# EasyEDA Pro project PCB-steeringWheel.epro

# Board PCB1
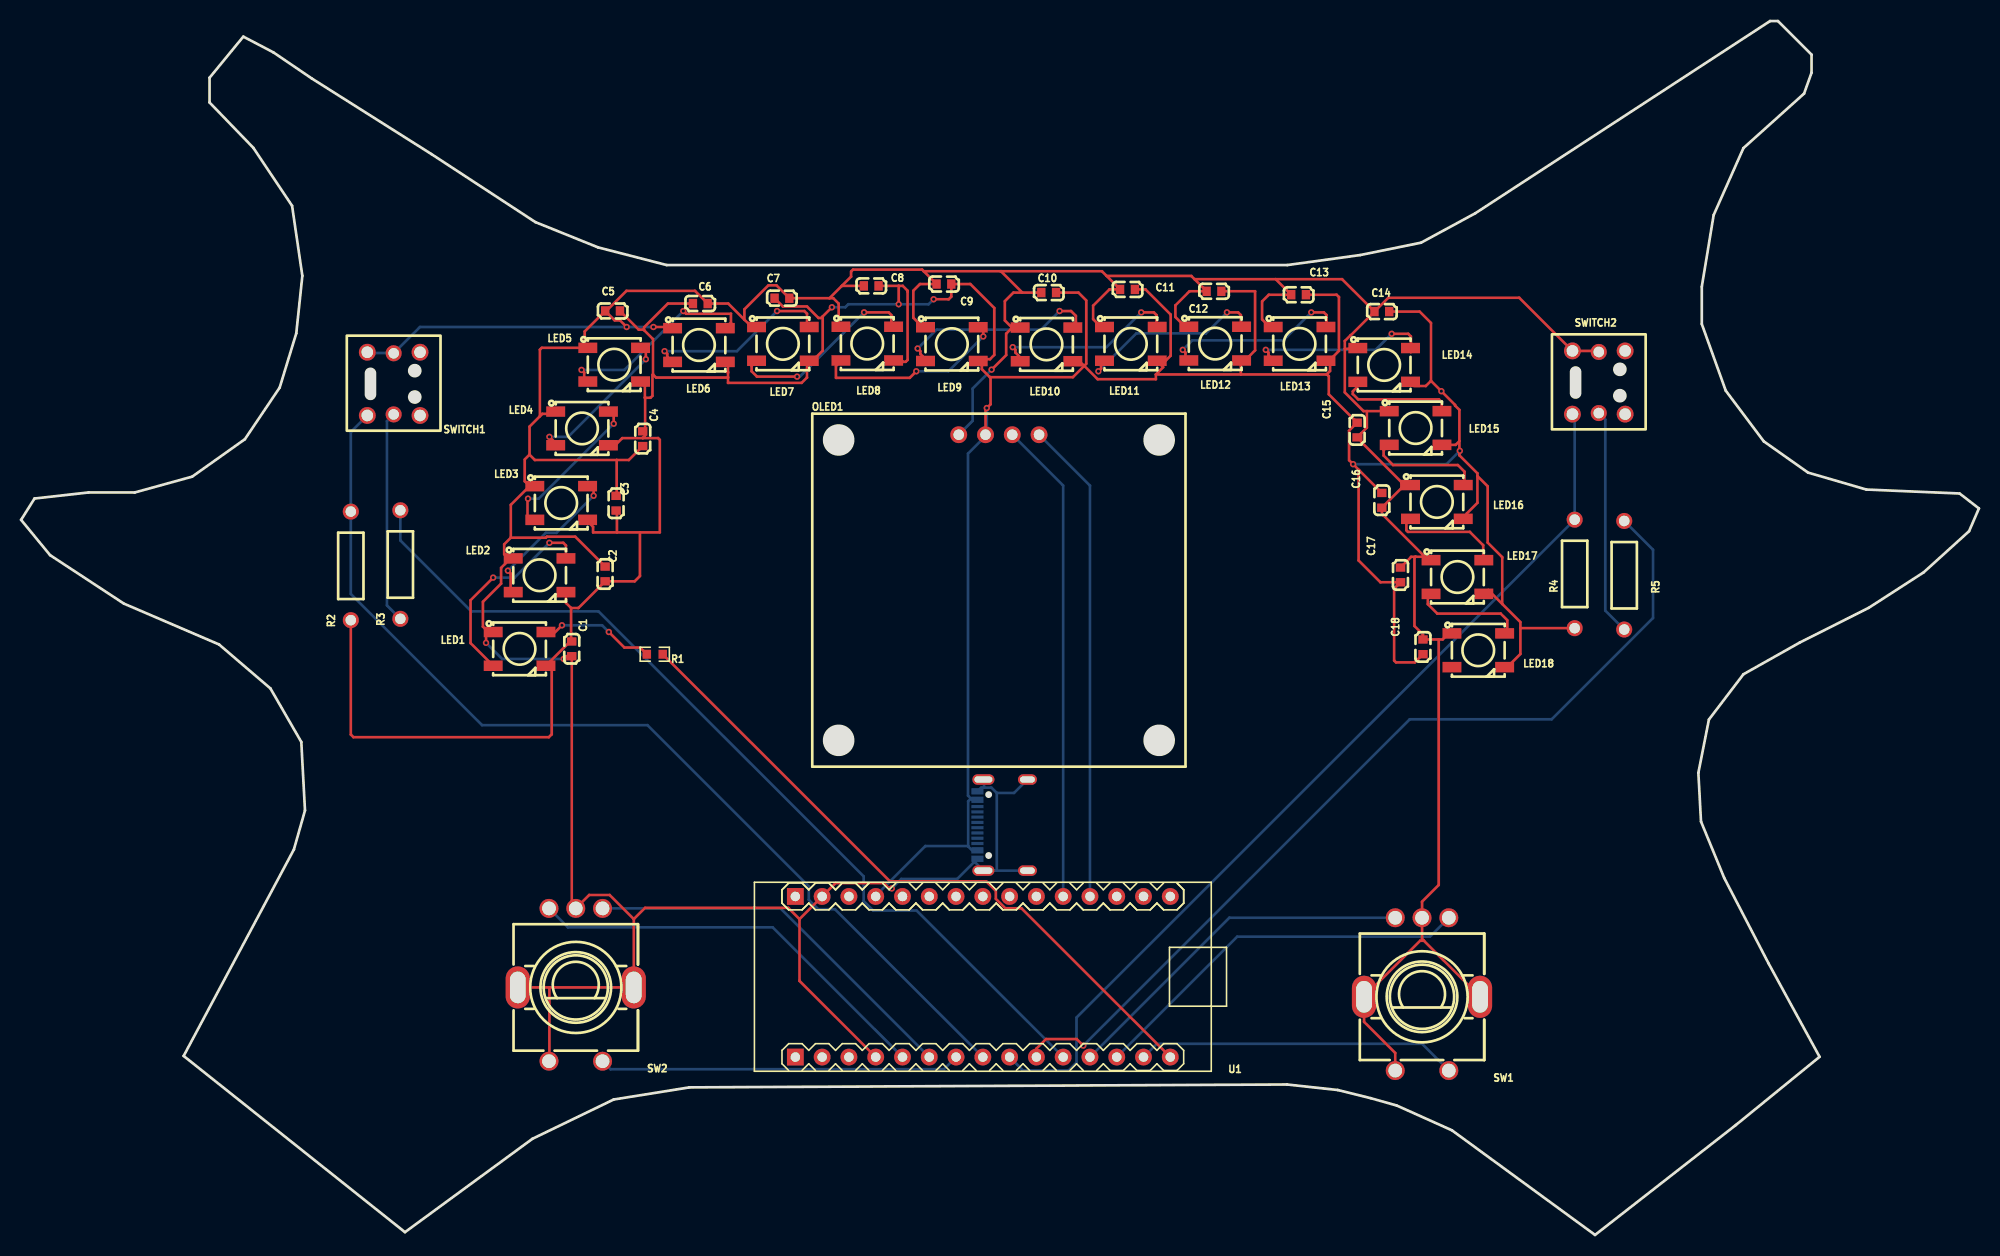
[diagram p0: board, top side]
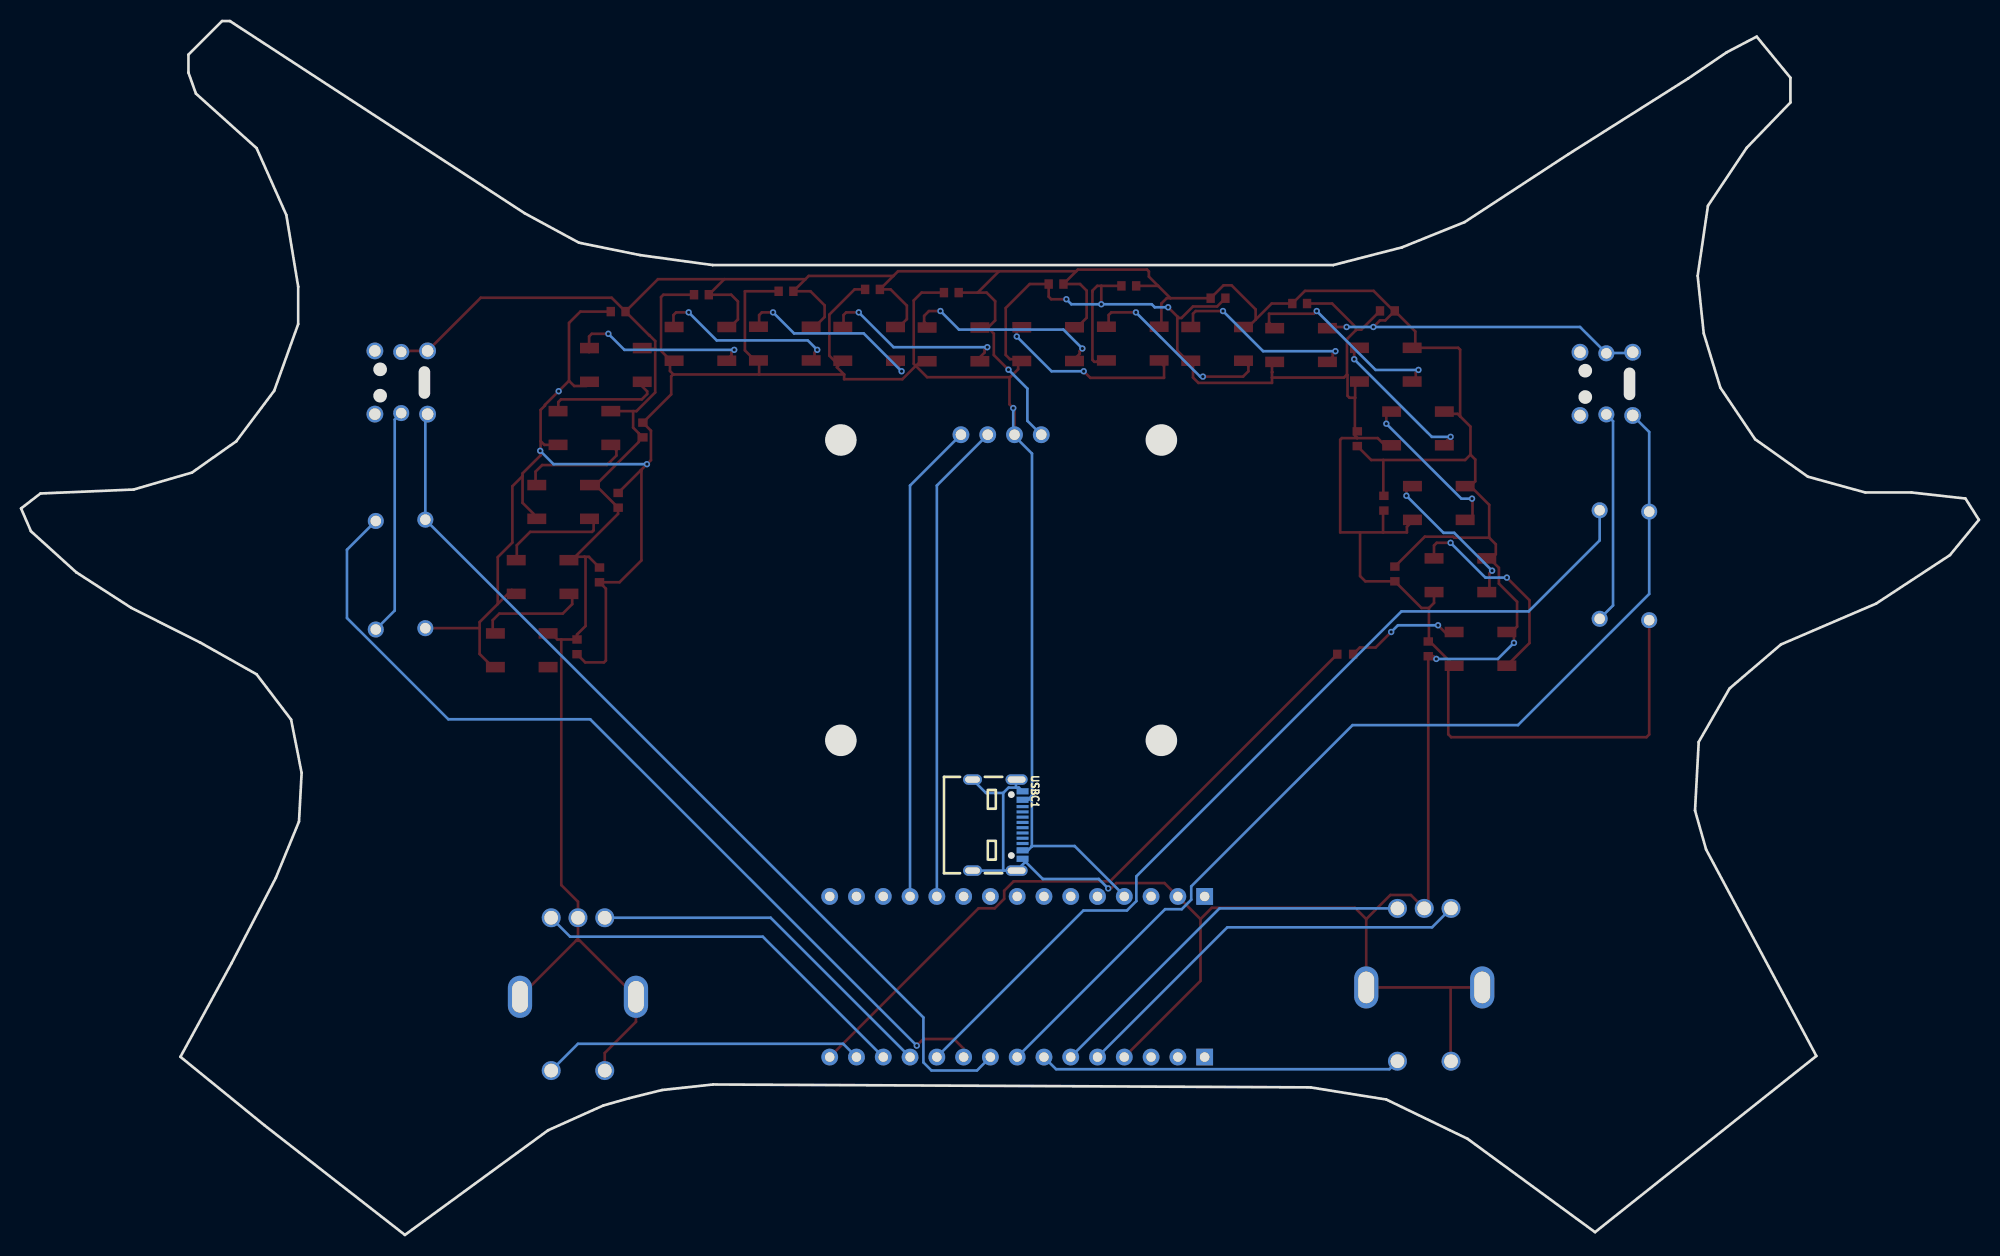
[diagram p1: board, bottom side, seen from below]

Outline 185.69 x 115.18 mm; copper layers: Top Layer, Bottom Layer. Coordinates in mm from the lower left corner of the outline.
Outline path: 0,67.85 2.75,64.5 9.75,59.9 18.78,56.03 23.65,51.85 26.58,46.78 26.93,40.28 25.88,36.58 15.42,16.98 36.41,0.26 48.5,9.13 56.2,12.85 63.38,14 120.06,14.28 124.88,13.75 128.01,12.98 130.48,12.28 135.71,9.93 149.28,0 162.63,10.43 170.58,16.9 165.73,25.78 161.53,33.88 159.33,39.23 159.08,43.85 160.08,48.9 163.36,53.2 168.68,56.2 175.23,59.5 180.46,62.88 184.76,66.78 185.69,68.93 183.86,70.35 175.01,70.73 169.48,72.34 165.28,75.3 161.68,80.1 159.41,86.43 159.41,89.98 160.53,96.78 163.36,103.13 169.11,108.3 169.82,110.28 169.82,112 166.63,115.18 165.88,115.18 137.92,96.94 132.78,94.15 127.01,92.98 120.09,92.03 61.23,92.03 54.73,93.7 48.78,96.1 38.92,102.56 27.58,109.73 23.94,112.21 21.08,113.71 17.88,109.8 17.88,107.45 22.03,103.15 25.7,97.65 26.68,91 26.1,85.55 24.53,80.4 21.23,75.5 16.23,71.95 10.78,70.45 6.4,70.45 1.27,69.88 0,67.85
Stack: Top Layer 0.035mm / Dielectric1 1.51mm FR4 er 4.5 / Bottom Layer 0.035mm

## Design rules (mm)
template: JLCPCB Capability(Two Layers Board)
spacing copperThickness1oz (default): track to track 0.102, other pairs 0.152 to 0.3
spacing copperThickness2oz: track to track 0.203, other pairs 0.152 to 0.3
track width copperThickness1oz (default): min 0.127, default 0.254, max 2.54
track width copperThickness2oz: min 0.203, default 0.254, max 2.54
differential pair differentialPair (default): width min 0.127, default 0.254, max 2.54; gap min 0.152, default 0.152
via viaSize (default): diameter min 0.5, default 0.61, max 10; hole min 0.3, default 0.305, max 6.3

## Placement (name value [footprint] x y rotation side)
C1  100nF  [C0603]  52.23 55.61 270 top
C2  100nF  [C0603]  55.39 62.72 90 top
C3  100nF  [C0603]  56.44 69.43 90 top
C4  100nF  [C0603]  58.96 75.55 270 top
C5  100nF  [C0603]  56.1 87.68 180 top
C6  100nF  [C0603]  64.42 88.38 0 top
C7  100nF  [C0603]  72.17 88.89 0 top
C8  100nF  [C0603]  80.63 90.05 180 top
C9  100nF  [C0603]  87.53 90.23 180 top
C10  100nF  [C0603]  97.47 89.42 180 top
C11  100nF  [C0603]  104.94 89.72 180 top
C12  100nF  [C0603]  113.14 89.54 180 top
C13  100nF  [C0603]  121.17 89.21 180 top
C14  100nF  [C0603]  129.06 87.62 180 top
C15  100nF  [C0603]  126.72 76.38 270 top
C16  100nF  [C0603]  129.06 69.71 270 top
C17  100nF  [C0603]  130.83 62.63 90 top
C18  100nF  [C0603]  132.96 55.8 90 top
LED1  WS2812B-V5/W  [LED-SMD_4P-L5.0-W5.0-TL-1]  47.27 55.61 0 top
LED2  WS2812B-V5/W  [LED-SMD_4P-L5.0-W5.0-TL-1]  49.18 62.6 0 top
LED3  WS2812B-V5/W  [LED-SMD_4P-L5.0-W5.0-TL-1]  51.23 69.45 0 top
LED4  WS2812B-V5/W  [LED-SMD_4P-L5.0-W5.0-TL-1]  53.2 76.53 0 top
LED5  WS2812B-V5/W  [LED-SMD_4P-L5.0-W5.0-TL-1]  56.25 82.58 0 top
LED6  WS2812B-V5/W  [LED-SMD_4P-L5.0-W5.0-TL-1]  64.29 84.44 0 top
LED7  WS2812B-V5/W  [LED-SMD_4P-L5.0-W5.0-TL-1]  72.25 84.55 0 top
LED8  WS2812B-V5/W  [LED-SMD_4P-L5.0-W5.0-TL-1]  80.25 84.58 0 top
LED9  WS2812B-V5/W  [LED-SMD_4P-L5.0-W5.0-TL-1]  88.28 84.53 0 top
LED10  WS2812B-V5/W  [LED-SMD_4P-L5.0-W5.0-TL-1]  97.25 84.5 0 top
LED11  WS2812B-V5/W  [LED-SMD_4P-L5.0-W5.0-TL-1]  105.25 84.55 0 top
LED12  WS2812B-V5/W  [LED-SMD_4P-L5.0-W5.0-TL-1]  113.26 84.58 0 top
LED13  WS2812B-V5/W  [LED-SMD_4P-L5.0-W5.0-TL-1]  121.26 84.55 0 top
LED14  WS2812B-V5/W  [LED-SMD_4P-L5.0-W5.0-TL-1]  129.28 82.55 0 top
LED15  WS2812B-V5/W  [LED-SMD_4P-L5.0-W5.0-TL-1]  132.26 76.57 0 top
LED16  WS2812B-V5/W  [LED-SMD_4P-L5.0-W5.0-TL-1]  134.28 69.55 0 top
LED17  WS2812B-V5/W  [LED-SMD_4P-L5.0-W5.0-TL-1]  136.23 62.43 0 top
LED18  WS2812B-V5/W  [LED-SMD_4P-L5.0-W5.0-TL-1]  138.21 55.48 0 top
OLED1  HS13L03W2C01  [OLED-TH_L35.4-W33.5_HS13L03W2C01]  92.74 75.93 0 top
R1  470Ω  [R0603]  60.1 55.1 180 top
R2  220Ω  [RES-TH_BD2.4-L6.3-P10.30-D0.6]  31.27 63.49 90 top
R3  220Ω  [RES-TH_BD2.4-L6.3-P10.30-D0.6]  35.97 63.61 90 top
R4  220Ω  [RES-TH_BD2.4-L6.3-P10.30-D0.6]  147.35 62.72 90 top
R5  220Ω  [RES-TH_BD2.4-L6.3-P10.30-D0.6]  152.05 62.6 90 top
SW1  EC11E09244BS  [SW-TH_EC11XXXXXXXX]  132.87 22.85 180 top
SW2  EC11E09244BS  [SW-TH_EC11XXXXXXXX]  52.61 23.73 180 top
SWITCH1  K6-6275D03  [SW-TH_K6-6275D03]  35.34 80.76 180 top
SWITCH2  K6-6275D03  [SW-TH_K6-6275D03]  149.64 80.88 180 top
U1  ARDUINO_NANO  [COMM-TH_ARDUINO_NANO]  91.22 24.5 180 top
USBC1  MC-311D  [USB-C-SMD_MC-311D]  93.08 38.89 270 bottom

## Footprints (pads in the part's own frame, mm; a bottom-side part is the same pattern mirrored in y, then rotated)
C0603
  rect 0.8x0.9 smd: 1(-0.7,0) 2(0.7,0)
COMM-TH_ARDUINO_NANO
  rect 1.6x1.6 hole 0.9: 1(17.78,7.62) 30(17.78,-7.62)
  round 1.6 hole 0.9: 2(15.24,7.62) 3(12.7,7.62) 4(10.16,7.62) 5(7.62,7.62) 6(5.08,7.62) 7(2.54,7.62) 8(0,7.62) 9(-2.54,7.62) 10(-5.08,7.62) 11(-7.62,7.62) 12(-10.16,7.62) 13(-12.7,7.62) 14(-15.24,7.62) 15(-17.78,7.62) 16(-17.78,-7.62) 17(-15.24,-7.62) 18(-12.7,-7.62) 19(-10.16,-7.62) 20(-7.62,-7.62) 21(-5.08,-7.62) 22(-2.54,-7.62) 23(0,-7.62) 24(2.54,-7.62) 25(5.08,-7.62) 26(7.62,-7.62) 27(10.16,-7.62) 28(12.7,-7.62) 29(15.24,-7.62)
LED-SMD_4P-L5.0-W5.0-TL-1
  rect 1.8x1 smd: 1(-2.5,1.6) 2(-2.5,-1.6) 3(2.5,-1.6) 4(2.5,1.6)
OLED-TH_L35.4-W33.5_HS13L03W2C01
  round 1.6 hole 1: 1(-3.81,0) 2(-1.27,0) 3(1.27,0) 4(3.81,0)
R0603
  rect 0.806x0.864 smd: 1(-0.753,0) 2(0.753,0)
RES-TH_BD2.4-L6.3-P10.30-D0.6
  round 1.524 hole 1: 1(-5.15,0) 2(5.15,0)
SW-TH_EC11XXXXXXXX
  oval 2.3x4 hole 1.5x3: 6(5.5,0.25) 7(-5.5,0.25)
  round 1.8 hole 1.3: A(-2.54,-7.25) B(2.54,-7.25) C(0,-7.25) D(-2.54,7.25) E(2.54,7.25)
SW-TH_K6-6275D03
  round 1.6 hole 1.1: 1(-2.5,-3) 2(2.5,-3) 3(2.5,3) 4(-2.5,3)
  round 1.524 hole 1: 5(0,2.9) 6(0,-2.9)
USB-C-SMD_MC-311D
  oval 1x2.1 hole 0.6x1.7: 1(-4.32,1.808) 4(4.32,1.808)
  oval 1x1.8 hole 0.6x1.4: 2(-4.32,-2.373) 3(4.32,-2.373)
  rect 0.6x1.15 smd: A1-B12(-3.2,2.373) A4-B9(-2.4,2.373) B1-A12(3.2,2.373) B4-A9(2.4,2.373)
  rect 0.3x1.15 smd: A5(-1.25,2.373) A6(-0.25,2.373) A7(0.25,2.373) A8(1.25,2.373) B5(1.75,2.373) B6(0.75,2.373) B7(-0.75,2.373) B8(-1.75,2.373)

## Nets
+5V: C1.1 C2.1 C3.1 C4.1 C5.1 C6.1 C7.1 C8.1 C9.1 C10.1 C11.1 C12.1 C13.1 C14.1 C15.1 C16.1 C17.1 C18.1 LED1.3 LED2.3 LED3.3 LED4.3 LED5.3 LED6.3 LED7.3 LED8.3 LED9.3 LED10.3 LED11.3 LED12.3 LED13.3 LED14.3 LED15.3 LED16.3 LED17.3 LED18.3 OLED1.2 R2.1 R4.1 U1.27 USBC1.A4-B9 USBC1.B4-A9
GND: C1.2 C2.2 C3.2 C4.2 C5.2 C6.2 C7.2 C8.2 C9.2 C10.2 C11.2 C12.2 C13.2 C14.2 C15.2 C16.2 C17.2 C18.2 LED1.1 LED2.1 LED3.1 LED4.1 LED5.1 LED6.1 LED7.1 LED8.1 LED9.1 LED10.1 LED11.1 LED12.1 LED13.1 LED14.1 LED15.1 LED16.1 LED17.1 LED18.1 OLED1.1 SW1.6 SW1.7 SW1.C SW1.E SW2.6 SW2.7 SW2.C SW2.E SWITCH1.2 SWITCH1.6 SWITCH2.2 SWITCH2.6 U1.4 U1.29 USBC1.1 USBC1.2 USBC1.3 USBC1.4 USBC1.A1-B12 USBC1.B1-A12
6A7: LED6.2 LED7.4
12A13: LED12.2 LED13.4
18A19: LED18.2
ALIM_DIODE1: R3.2 U1.11
ALIM_DIODE2: R5.2 U1.10
ENTRE_PULL_UP1: R2.2 SWITCH1.3 U1.8
ENTRE_PULL_UP2: R4.2 SWITCH2.3 U1.9
$1N1356: LED5.2 LED6.4
$1N1384: LED4.2 LED5.4
$1N6661: R1.1 U1.15
$1N11718: LED1.4 R1.2
$1N12578: LED1.2 LED2.4
$1N12584: LED2.2 LED3.4
$1N12669: LED3.2 LED4.4
$1N13146: LED10.2 LED11.4
$1N13147: LED11.2 LED12.4
$1N13172: LED7.2 LED8.4
$1N13176: LED8.2 LED9.4
$1N13211: LED9.2 LED10.4
$1N13647: LED16.2 LED17.4
$1N13648: LED17.2 LED18.4
$1N13673: LED13.2 LED14.4
$1N13677: LED14.2 LED15.4
$1N13712: LED15.2 LED16.4
$1N15251: SW1.B U1.12
$1N15272: SW1.D U1.14
$1N15359: SW1.A U1.13
$1N15481: SW2.B U1.5
$1N15489: SW2.A U1.6
$1N15542: SW2.D U1.7
$1N16035: R3.1 SWITCH1.5
$1N16039: R5.1 SWITCH2.5
$1N21138: OLED1.4 U1.19
$1N21143: OLED1.3 U1.20

Pads without a net: SWITCH1 1 4; SWITCH2 1 4; U1 1 2 3 16 17 18 21 22 23 24 25 26 28 30; USBC1 A5 A6 A7 A8 B5 B6 B7 B8

## Via types
v1: diameter 0.61, hole 0.305, Top Layer to Bottom Layer, 42 vias

## Routing (per net, layer and track width the routed paths; a pad name or vN(x,y) marks a point on that pad's centre or on a via; arc(x,y) is an arc through that point)
+5V: length 415.5
  Top Layer w0.254: 138.13,72 138.13,69.47 137.11,68.45 137.11,68.2 136.9,68.24 ; 138.13,72 138.13,72 139.1,71.04 139.1,65.7 140.48,64.31 140.48,59.87 ; 138.13,72 138.13,72.26 136.42,73.97 136.42,75.33 ; C6.1 61.34,88.38 59.08,86.11 59.08,85.86 ; 91.95,81.39 91.88,81.39 91.12,82.15 91.12,83.09 ; 91.95,81.39 91.95,78.82 91.47,78.34 OLED1.2 ; 91.95,81.39 99.76,81.39 100.84,82.47 ; 140.48,59.87 139.16,61.2 139.08,61.12 138.67,61.12 ; 140.48,59.87 142.2,58.15 142.2,57.58 ; C12.1 117.04,89.54 117.04,83.94 116.07,82.97 ; 142.2,57.58 147.35,57.58 ; 142.2,57.58 142.2,55.13 140.96,53.88 ; 123.82,82.97 124.15,82.64 124.15,81.98 123.82,81.65 ; 91.12,83.09 91.07,83.09 ; 91.12,83.09 91.9,83.09 92.3,83.5 92.3,87.95 90.03,90.23 C9.1 88.23,89.03 87.99,88.79 v1(86.55,88.79) ; 83.23,90.05 83.24,90.05 v1(83.24,88.31) ; 83.23,90.05 C8.1 ; 83.23,90.05 83.62,90.05 84.08,89.59 84.08,89.52 84.08,89.52 84.08,83.03 83.9,82.85 83.65,82.85 83.58,82.91 83.07,82.91 ; 52.16,56.31 52.16,59.49 ; 52.16,56.31 C1.1 ; 52.16,56.31 52.07,56.31 LED1.3 ; 52.16,59.49 51.68,59.97 LED2.3 ; 52.16,59.49 52.86,59.49 C2.1 58.2,62.02 58.7,62.52 58.7,66.66 ; 58.7,66.66 56.51,66.66 ; 58.7,66.66 60.58,66.66 60.58,75.45 60.42,75.61 58.97,75.61 ; 56.51,66.66 56.51,68.66 C3.1 ; 56.51,66.66 54.25,66.66 54.25,67.19 53.59,67.85 ; C5.1 58.58,85.91 59.04,85.91 59.08,85.86 ; 58.66,81.06 58.66,81.04 59.16,80.54 59.16,79.44 ; 133.72,81.04 v1(134.71,80.06) 136.01,78.76 136.01,78.69 136.42,78.28 136.42,75.33 ; 133.72,81.04 133.23,80.55 132.07,80.55 ; 133.72,81.04 133.72,86.54 132.64,87.62 C14.1 ; 136.42,75.33 136.06,74.97 LED15.3 ; 100.84,82.47 100.03,83.18 99.81,83.22 ; 100.84,82.47 102.11,81.2 107.63,81.2 107.63,81.65 ; 100.84,82.47 101.03,82.66 101.03,88.67 100.28,89.42 C10.1 ; 74.54,82.71 74.54,81.36 74.03,80.85 67.05,80.85 67.05,81.35 ; 126.9,72.57 v1(126.33,73.14) 125.95,73.52 125.95,76.32 C15.1 124.03,79.76 124.03,81.48 123.86,81.65 123.82,81.65 ; 126.9,72.57 C16.1 ; 126.9,72.57 126.86,72.52 126.86,64 128.93,61.93 C17.1 130.23,61.32 130.23,54.51 130.41,54.33 132.19,54.33 C18.1 ; 76.03,87.15 75.88,87.01 75.63,87.01 74.54,88.1 72.25,88.1 C7.1 ; 76.03,87.15 76.03,83.9 75.08,82.95 LED7.3 ; 76.03,87.15 v1(76.9,88.02) ; 115.69,81.65 123.82,81.65 ; 115.69,81.65 107.63,81.65 ; 115.69,81.65 115.69,82.97 ; 56.12,74.71 57.02,75.61 58.97,75.61 ; 59.93,81.64 59.88,81.59 59.88,79.62 59.7,79.44 59.16,79.44 ; 59.93,81.64 59.93,85.01 59.08,85.86 ; 59.93,81.64 60.22,81.35 67.05,81.35 ; 67.05,81.35 67.05,81.83 67.02,81.87 67.05,81.9 67.05,82.59 LED6.3 ; 59.16,79.44 59.19,79.41 59.19,75.86 58.97,75.63 58.97,75.61 ; 108.07,82.97 108.57,82.97 109.03,83.43 109.03,87.33 106.64,89.72 C11.1 ; 107.63,81.65 108.32,82.34 107.69,82.97 ; R2.1 31.27,47.48 31.53,47.23 50.05,47.23 50.33,47.5 50.33,54.03 50.07,54.29 ; C13.1 124.77,89.21 124.99,88.99 124.99,83.89 124.07,82.97
  Bottom Layer w0.254: 90.08,41.41 89.83,41.15 89.83,36.9 ; 90.08,41.41 90.2,41.29 USBC1.A4-B9 ; 90.08,41.41 89.81,41.68 89.81,74.14 91.59,75.92 v1(91.59,78.46) ; 89.83,36.9 85.76,36.9 81.27,32.41 81.27,32.33 U1.27 ; 89.83,36.9 89.83,36.86 90.2,36.49 USBC1.B4-A9 ; v1(76.9,88.02) 78.17,88.02 78.46,88.31 v1(83.24,88.31) 86.08,88.31 v1(86.55,88.79) ; v1(126.33,73.14) 135.19,73.14 v1(136.46,74.4)
GND: length 502.5
  Top Layer w0.254: 56.49,73.53 56.49,70.19 C3.2 ; 56.49,73.53 48.73,73.53 48.22,74.04 ; 56.49,73.53 57.64,73.53 C4.2 ; 129.07,69.02 129.07,68.42 133.14,64.35 ; 129.07,69.02 C16.2 ; 129.07,69.02 130.91,70.86 130.91,71.44 ; 93.99,86.09 93.3,86.77 93.3,88.6 94.12,89.42 94.96,89.42 ; 93.99,86.09 93.43,85.52 93.43,83.49 v1(92.04,82.1) ; 93.99,86.09 94.33,86.42 94.81,86.42 ; 133.14,64.35 133.41,64.35 ; 133.14,64.35 132.26,64.35 ; 46.45,66.16 46.45,69.28 48.22,71.05 ; 46.45,66.16 45.82,65.54 45.82,64.59 46.45,63.96 ; 46.45,66.16 49.77,66.16 49.87,66.26 52.56,66.26 C2.2 ; 133.05,27.92 SW1.7 ; 133.05,27.92 132.87,28.1 SW1.C ; 133.05,27.92 132.69,27.92 SW1.6 127.37,20.22 130.33,17.26 SW1.E ; 46.45,63.96 46.4,63.92 46.15,63.92 45.53,63.3 45.53,61.8 43.8,60.08 43.8,57.71 44.37,57.15 ; 46.45,63.96 LED2.1 ; C17.2 131.83,64.32 ; C8.2 77.85,90.05 ; 77.85,90.05 78.72,90.93 78.72,91.42 78.9,91.6 85.46,91.6 85.62,91.44 ; 77.85,90.05 76.68,88.89 ; v1(44.1,56.18) 44.1,56.88 44.37,57.15 ; 73.83,29.97 72.76,31.04 59.18,31.04 58.11,29.97 ; 73.83,29.97 73.83,24.1 U1.4 ; 73.83,29.97 U1.29 77.25,33.39 81.82,33.39 82.33,32.88 v1(82.58,32.88) ; 76.68,88.89 77.03,88.89 77.54,88.38 77.54,85.91 ; 76.68,88.89 C7.2 71.65,90.1 70.88,90.1 68.6,87.83 68.6,86.85 ; 118.99,90.69 C13.2 118.34,89.21 117.71,88.58 117.71,86.87 118.41,86.17 ; 118.99,90.69 111.3,90.69 ; 118.99,90.69 125.29,90.69 C14.2 ; 127.1,76.07 127.64,76.61 127.64,78.17 ; 127.1,76.07 127.1,75.25 130.91,71.44 ; 127.1,76.07 C15.2 ; 92.94,91.44 102.52,91.44 102.96,91 ; 92.94,91.44 94.96,89.42 ; 92.94,91.44 85.62,91.44 ; v1(57.43,86.15) 56.81,86.78 56.3,86.78 55.58,87.5 55.58,87.75 57.41,89.58 63.92,89.58 C6.2 67.08,88.38 68.6,86.85 ; 85.62,91.44 C9.2 85.25,90.23 84.63,89.6 84.63,87.02 85.36,86.29 85.41,86.29 ; 49.21,77.68 48.22,76.7 48.22,74.04 ; 49.21,77.68 49.21,84 49.38,84.18 53.46,84.18 ; 49.21,77.68 49.44,77.91 51.12,77.91 ; 44.37,57.15 44.43,57.21 LED1.1 ; LED14.1 126.71,84.08 125.55,84.08 ; 96.79,89.42 94.96,89.42 ; C14.2 129.68,88.93 142.09,88.93 SWITCH2.2 149.54,83.88 149.64,83.78 ; C14.2 126.12,85.38 126.1,85.38 125.55,84.82 125.55,84.08 ; 68.6,86.85 69.54,85.91 ; 125.55,84.08 125.55,79.94 127.32,78.17 127.64,78.17 ; 111.3,90.69 110.99,91 102.96,91 ; 111.3,90.69 C12.2 110.82,89.54 109.48,88.2 109.48,87.1 110.41,86.17 ; 132.26,64.35 132.16,64.25 132.16,57.78 132.96,56.97 C18.2 134.45,56.5 ; 132.26,64.35 131.83,64.35 ; 102.96,91 C11.2 103.22,89.72 101.68,88.18 101.68,86.9 102.41,86.17 ; 130.91,71.44 131.9,71.44 ; 48.22,74.04 47.77,73.58 47.77,71.51 48.22,71.05 ; v1(51.47,54.66) 51.72,54.91 C1.2 52.23,31.37 SW2.C 53.88,32.25 55.82,32.25 58.11,29.97 ; 50.11,23.48 SW2.7 58.11,29.97 ; 50.11,23.48 SW2.6 ; 50.11,23.48 50.11,16.52 SW2.E ; C5.2 53.46,85.73 53.46,84.18 ; 127.64,78.17 129.74,78.17 ; 48.22,71.05 48.59,71.05 ; 132.87,30.92 132.87,31.62 134.45,33.2 134.45,56.5 ; LED6.1 61.24,86.04 61.13,86.15 v1(59.98,86.15) ; 134.45,56.5 134.83,56.5 135.41,57.08 ; 133.41,64.35 133.67,64.32 ; LED5.1 53.46,84.18
  Bottom Layer w0.254: v1(51.47,54.66) 45.62,54.66 v1(44.1,56.18) ; SWITCH1.2 32.91,83.68 35.36,83.68 ; 90.36,35.35 90.49,35.35 USBC1.4 92.54,34.57 ; 90.36,35.35 USBC1.B1-A12 ; 90.36,35.35 88.79,33.78 83.48,33.78 v1(82.58,32.88) ; 35.36,83.68 37.83,86.15 v1(57.43,86.15) v1(59.98,86.15) ; 35.36,83.68 SWITCH1.6 ; 92.54,41.94 94.18,41.94 USBC1.2 ; 92.54,41.94 92.03,42.45 91.33,42.45 ; 92.54,41.94 92.54,34.57 ; 91.33,42.45 91.06,42.45 USBC1.A1-B12 ; 91.33,42.45 91.33,43.15 USBC1.1 ; v1(92.04,82.1) 90.25,80.31 90.25,77.25 OLED1.1 ; 92.54,34.57 USBC1.3
6A7: length 18
  Top Layer w0.254: LED6.2 61.29,83.35 61.29,83.6 v1(61.03,83.86) ; v1(71.7,87.67) 74.29,87.67 74.54,87.41 74.54,85.91
  Bottom Layer w0.254: v1(61.03,83.86) 67.89,83.86 v1(71.7,87.67)
12A13: length 17.6
  Top Layer w0.254: 110.69,82.97 110.43,83.22 110.43,83.73 v1(110.18,83.98) ; 123.82,86.17 123.82,87.29 123.56,87.54 v1(122.37,87.54)
  Bottom Layer w0.254: v1(110.18,83.98) 111.08,84.88 119.71,84.88 v1(122.37,87.54)
ALIM_DIODE1: length 87.4
  Bottom Layer w0.254: R3.2 35.97,65.9 42.7,59.17 54.77,59.17 79.91,34.02 79.91,31.68 80.81,30.78 84.93,30.78 U1.11
ALIM_DIODE2: length 87.1
  Top Layer w0.254: v1(100.74,17.96) 100.12,18.59 97.21,18.59 96.3,17.68 U1.10
  Bottom Layer w0.254: v1(100.74,17.96) 131.71,48.93 145.17,48.93 154.78,58.54 154.78,65.01 R5.2
ENTRE_PULL_UP1: length 96.5
  Bottom Layer w0.254: SWITCH1.3 31.27,76.19 R2.2 31.27,60.82 43.72,48.37 59.41,48.37 74.71,33.08 74.71,31.81 75.6,30.91 77.19,30.91 U1.8
ENTRE_PULL_UP2: length 88.4
  Bottom Layer w0.254: SWITCH2.3 147.35,77.67 R4.2 100.11,20.63 100.11,16.37 99.34,15.61 95.03,15.61 U1.9
$1N1356: length 19.4
  Top Layer w0.254: v1(53.16,82.08) 53.41,81.82 53.41,81.32 53.66,81.06 ; v1(62.81,87.67) 63.06,87.41 67.33,87.41 67.33,86.58 LED6.4
  Bottom Layer w0.254: v1(53.16,82.08) 57.22,82.08 v1(62.81,87.67)
$1N1384: length 15.2
  Top Layer w0.254: 51.12,74.71 v1(50.11,75.73) ; 58.66,84.26 59,84.26 59.25,84.01 v1(59.25,83.09)
  Bottom Layer w0.254: v1(50.11,75.73) 51.89,75.73 v1(59.25,83.09)
$1N6661: length 64.4
  Top Layer w0.254: R1.1 82.41,33.55 91.55,33.55 92.45,32.65 92.45,31.89 93.35,30.99 94.88,30.99 U1.15
$1N11718: length 11.2
  Top Layer w0.254: LED1.4 50.03,56.96 50.41,56.96 v1(51.3,57.85) ; R1.2 58.71,55.74 57.22,55.74 v1(55.74,57.21)
  Bottom Layer w0.254: v1(51.3,57.85) 55.11,57.85 v1(55.74,57.21)
$1N12578: length 19.7
  Top Layer w0.254: v1(50.11,65.67) 51.43,65.67 51.68,65.42 LED2.4 ; v1(44.77,62.37) 42.63,60.22 42.63,56.16 LED1.2
  Bottom Layer w0.254: v1(44.77,62.37) 46.81,62.37 v1(50.11,65.67)
$1N12584: length 14.8
  Top Layer w0.254: v1(46.17,63.03) 46.43,62.77 46.43,61.25 LED2.2 ; 53.59,71.05 54.05,71.05 54.3,70.8 v1(54.3,70.14)
  Bottom Layer w0.254: v1(46.17,63.03) 49.76,66.62 50.78,66.62 v1(54.3,70.14)
$1N12669: length 14.5
  Top Layer w0.254: 56.12,77.91 56.2,77.83 v1(56.2,76.98) ; 48.59,67.85 48.29,67.85 48.03,68.11 48.03,69.82 v1(48.08,69.86)
  Bottom Layer w0.254: v1(56.2,76.98) 49.09,69.86 v1(48.08,69.86)
$1N13146: length 17.6
  Top Layer w0.254: v1(106.24,87.54) 107.43,87.54 107.69,87.29 107.69,86.17 ; v1(94.05,84.24) 94.3,83.98 94.3,83.73 94.81,83.22
  Bottom Layer w0.254: v1(106.24,87.54) 102.94,84.24 v1(94.05,84.24)
$1N13147: length 18.3
  Top Layer w0.254: v1(114.37,87.54) 115.43,87.54 115.69,87.29 115.69,86.17 ; v1(102.18,81.95) 102.43,82.21 102.43,82.71 102.69,82.97
  Bottom Layer w0.254: v1(114.37,87.54) 112.38,85.54 105.77,85.54 v1(102.18,81.95)
$1N13172: length 18.3
  Top Layer w0.254: 82.54,85.91 82.54,87.29 82.29,87.54 v1(79.95,87.54) ; 69.54,82.71 69.29,82.46 69.29,81.95 69.79,81.44 v1(73.6,81.44)
  Bottom Layer w0.254: v1(73.6,81.44) 73.86,81.44 v1(79.95,87.54)
$1N13176: length 18.3
  Top Layer w0.254: v1(91.26,85.25) 91.26,85.83 90.8,86.29 ; 77.54,82.71 77.29,82.46 77.29,81.33 84.28,81.33 v1(84.91,81.95)
  Bottom Layer w0.254: v1(84.91,81.95) 87.95,81.95 v1(91.26,85.25)
$1N13211: length 18.9
  Top Layer w0.254: 99.81,86.42 100.04,86.65 100.04,87.21 99.58,87.67 v1(98.5,87.67) ; 85.8,83.09 85.29,83.6 85.29,83.86 v1(85.03,84.11)
  Bottom Layer w0.254: v1(85.03,84.11) 86.83,85.91 96.74,85.91 v1(98.5,87.67)
$1N13647: length 10.6
  Top Layer w0.254: 131.9,68.24 131.39,67.73 131.39,66.86 131.54,66.71 137.41,66.71 138.67,65.44 138.67,64.32
$1N13648: length 10.8
  Top Layer w0.254: 133.67,61.12 133.42,60.87 133.42,59.85 134.32,58.96 140.33,58.96 140.96,58.33 140.96,57.08
$1N13673: length 17.3
  Top Layer w0.254: v1(129.99,85.51) 131.56,85.51 131.82,85.25 131.82,83.75 ; 118.82,82.97 118.31,83.48 118.31,83.73 v1(118.05,83.98)
  Bottom Layer w0.254: v1(129.99,85.51) 128.47,83.98 v1(118.05,83.98)
$1N13677: length 10.6
  Top Layer w0.254: 126.82,80.55 126.31,80.05 126.31,79.79 126.82,79.28 134.48,79.28 134.74,79.03 134.74,78.17
$1N13712: length 10.5
  Top Layer w0.254: 136.9,71.44 136.9,72.43 136.27,73.05 130.13,73.05 129.23,73.95 129.23,74.46 129.74,74.97
$1N15251: length 34.4
  Bottom Layer w0.254: SW1.B 114.6,30.1 U1.12
$1N15272: length 30.5
  Bottom Layer w0.254: U1.14 107.72,18.14 132.87,18.14 SW1.D
$1N15359: length 37
  Bottom Layer w0.254: U1.13 115.34,28.3 133.62,28.3 SW1.A
$1N15481: length 39.4
  Bottom Layer w0.254: U1.5 71.28,29.19 51.87,29.19 SW2.B
$1N15489: length 36.8
  Bottom Layer w0.254: U1.6 72.03,30.98 SW2.A
$1N15542: length 34.3
  Bottom Layer w0.254: U1.7 87.52,15.72 55.91,15.72 SW2.D
$1N16035: length 20.2
  Bottom Layer w0.254: SWITCH1.5 34.7,77.22 34.7,59.73 R3.1
$1N16039: length 21.5
  Bottom Layer w0.254: SWITCH2.5 150.25,77.37 150.25,59.24 152.05,57.45
$1N21138: length 45.8
  Bottom Layer w0.254: U1.19 101.38,71.11 OLED1.4
$1N21143: length 45.8
  Bottom Layer w0.254: U1.20 98.84,71.11 OLED1.3
